# Altium schematic sheet Relay_5VDC.SchDoc
size 304 x 304 mm; SheetNumber: 8; SheetTotal: 8
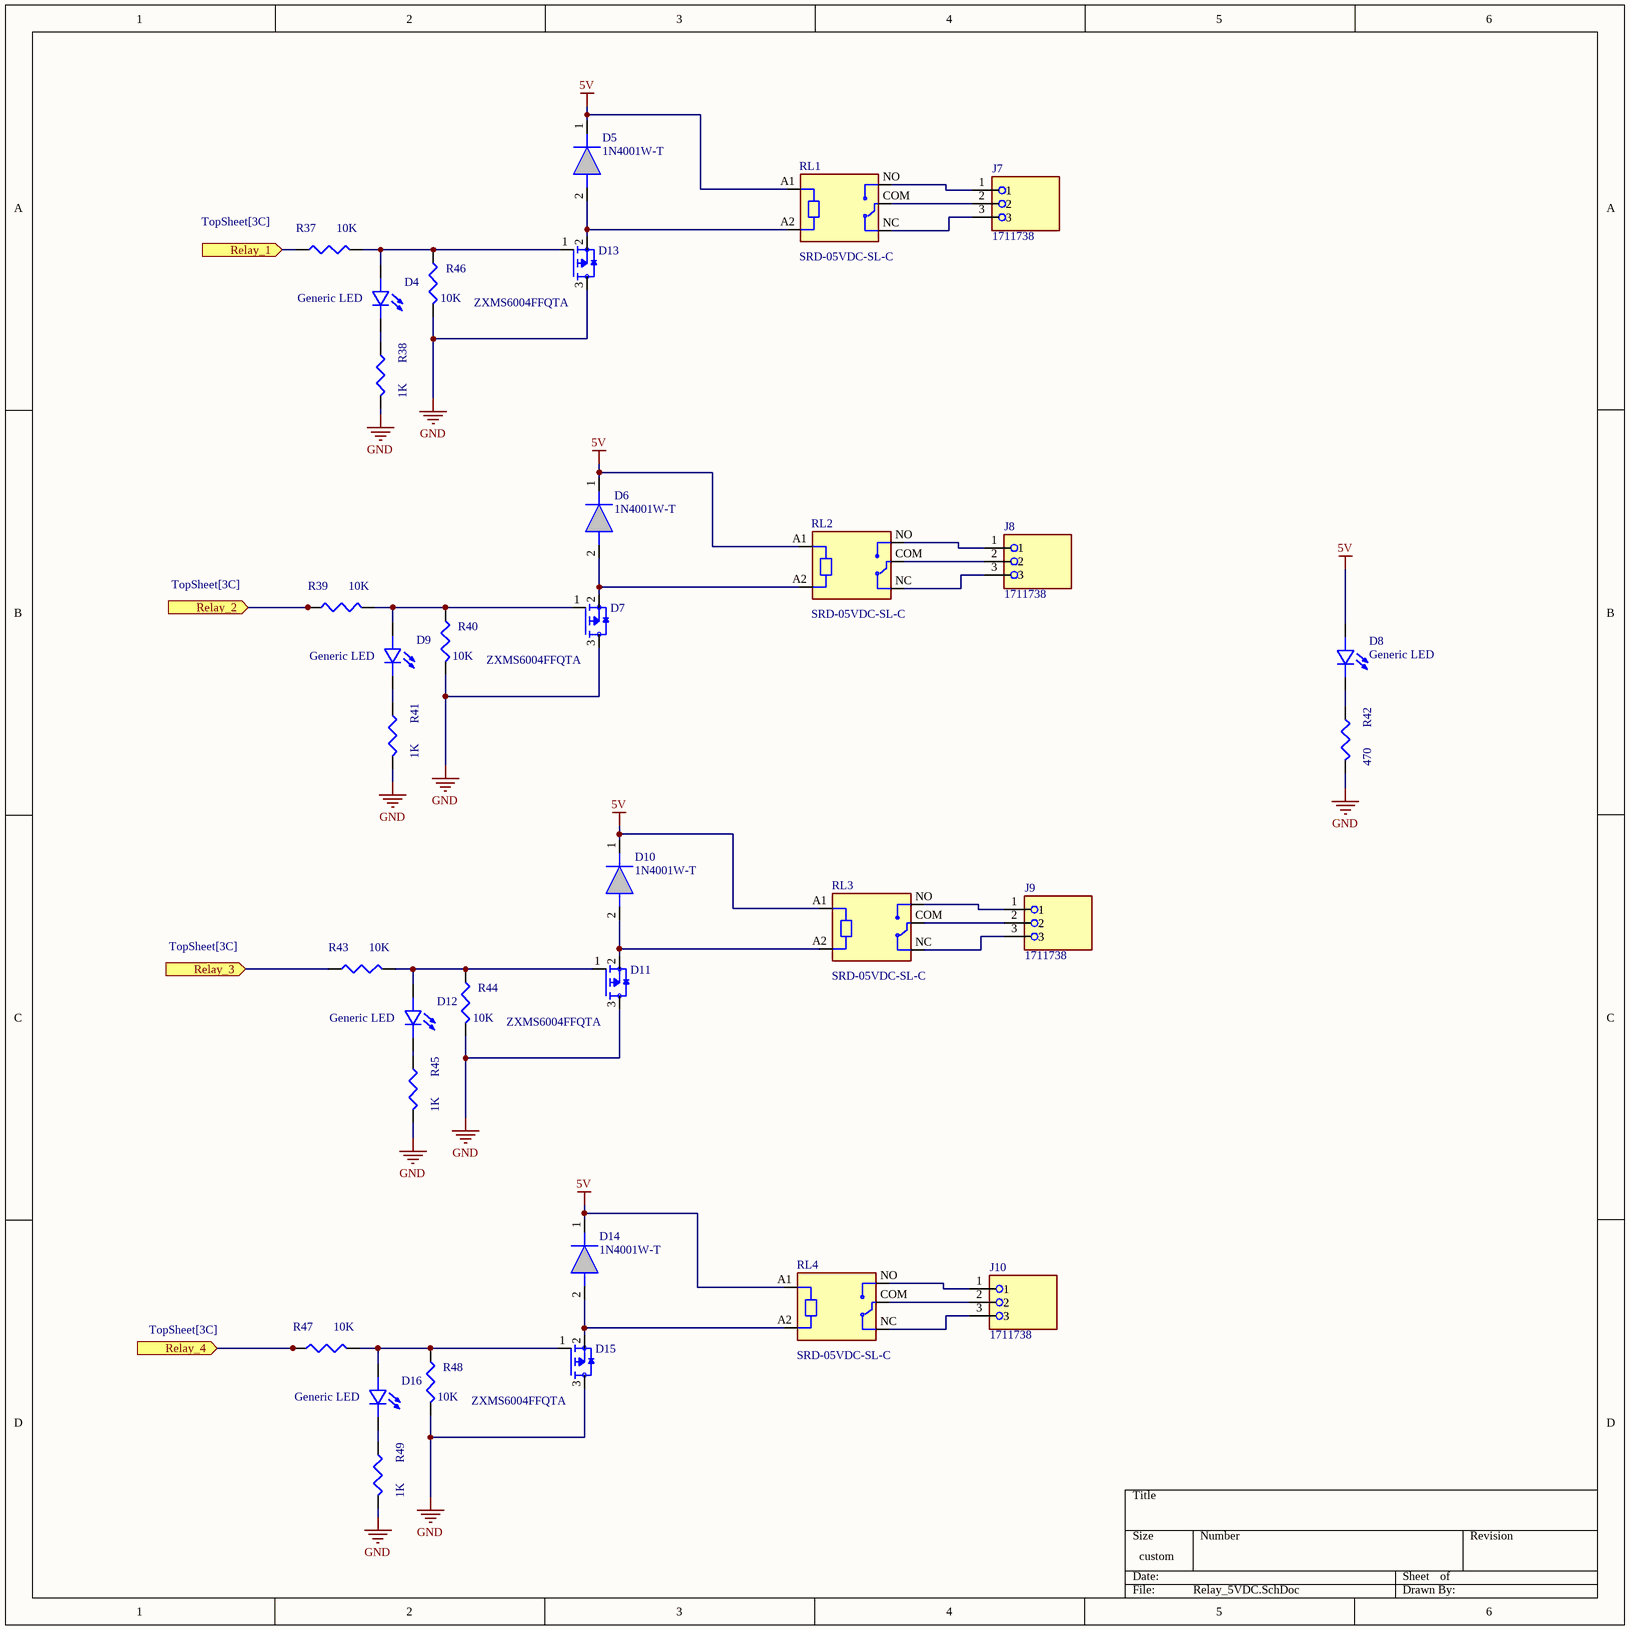
[diagram p0: Relay_5VDC.SchDoc]

## Parts
D4  Generic LED  [0603D-B]
D5  1N4001W-T  [SODFL3818X130N]
D6  1N4001W-T  [SODFL3818X130N]
D7  ZXMS6004FFQTA  [SOT95P240X100-3N]
D8  Generic LED  [0603D-B]
D9  Generic LED  [0603D-B]
D10  1N4001W-T  [SODFL3818X130N]
D11  ZXMS6004FFQTA  [SOT95P240X100-3N]
D12  Generic LED  [0603D-B]
D13  ZXMS6004FFQTA  [SOT95P240X100-3N]
D14  1N4001W-T  [SODFL3818X130N]
D15  ZXMS6004FFQTA  [SOT95P240X100-3N]
D16  Generic LED  [0603D-B]
J7  1711738  [1711738]
J8  1711738  [1711738]
J9  1711738  [1711738]
J10  1711738  [1711738]
R37  10K  [R0805]
R38  1K  [R0805]
R39  10K  [R0805]
R40  10K  [R0805]
R41  1K  [R0805]
R42  470  [R0603]
R43  10K  [R0805]
R44  10K  [R0805]
R45  1K  [R0805]
R46  10K  [R0805]
R47  10K  [R0805]
R48  10K  [R0805]
R49  1K  [R0805]
RL1  SRD-05VDC-SL-C  [SRD-05VDC-SL-C]
RL2  SRD-05VDC-SL-C  [SRD-05VDC-SL-C]
RL3  SRD-05VDC-SL-C  [SRD-05VDC-SL-C]
RL4  SRD-05VDC-SL-C  [SRD-05VDC-SL-C]

## Ports
Relay_1 (in, see TopSheet[3C]), Relay_2 (in, see TopSheet[3C]), Relay_3 (in, see TopSheet[3C]), Relay_4 (in, see TopSheet[3C])

## Nets
5V: D5.1(K) D6.1(K) D8.1(POS) D10.1(K) D14.1(K) RL1.A1 RL2.A1 RL3.A1 RL4.A1
GND: D7.3(D) D11.3(D) D13.3(D) D15.3(D) R38.2 R40.2 R41.2 R42.2 R44.2 R45.2 R46.2 R48.2 R49.2
Relay_1: R37.1 ; port Relay_1
Relay_2: R39.1 ; port Relay_2
Relay_3: R43.1 ; port Relay_3
Relay_4: R47.1 ; port Relay_4
NetD4_1: D4.1(POS) D13.1(G) R37.2 R46.1
NetD4_2: D4.2(NEG) R38.1
NetD5_2: D5.2(A) D13.2(S) RL1.A2
NetD6_2: D6.2(A) D7.2(S) RL2.A2
NetD7_1: D7.1(G) D9.1(POS) R39.2 R40.1
NetD8_2: D8.2(NEG) R42.1
NetD9_2: D9.2(NEG) R41.1
NetD10_2: D10.2(A) D11.2(S) RL3.A2
NetD11_1: D11.1(G) D12.1(POS) R43.2 R44.1
NetD12_2: D12.2(NEG) R45.1
NetD14_2: D14.2(A) D15.2(S) RL4.A2
NetD15_1: D15.1(G) D16.1(POS) R47.2 R48.1
NetD16_2: D16.2(NEG) R49.1
NetJ7_1: J7.1 RL1.NO
NetJ7_2: J7.2 RL1.COM
NetJ7_3: J7.3 RL1.NC
NetJ8_1: J8.1 RL2.NO
NetJ8_2: J8.2 RL2.COM
NetJ8_3: J8.3 RL2.NC
NetJ9_1: J9.1 RL3.NO
NetJ9_2: J9.2 RL3.COM
NetJ9_3: J9.3 RL3.NC
NetJ10_1: J10.1 RL4.NO
NetJ10_2: J10.2 RL4.COM
NetJ10_3: J10.3 RL4.NC

## Library data of the parts
D4 D8 D9 D12 D16 = LED: Generic LED SMD; MF: Osram; MP: LHN974 RED LED 1206; SnapEDA_Link: https://www.snapeda.com/parts/LHN974%20RED%20LED%201206/Osram/view-part/?ref=snap; Package: None; Value: *; Check_prices: https://www.snapeda.com/parts/LHN974%20RED%20LED%201206/Osram/view-part/?ref=eda
D5 D6 D10 D14 = 1N4001W-T: Rectifiers SOD-123,1A,50V,GP; Manufacturer_Name: Rectron; Geometry.Height: 1.3mm; Mouser Part Number: 583-1N4001W-T; Mouser Price/Stock: https://www.mouser.co.uk/ProductDetail/Rectron/1N4001W-T?qs=QNEnbhJQKvbnHIVMak28nQ%3D%3D; Manufacturer_Part_Number: 1N4001W-T; Datasheet Link: *
J7-J10 = 1711738: PCB Terminal Screw 5.08mm 12AWG 400V 24A 3 Position COMBICON MKDS Series | Phoenix Contact 1711738
R37-R49 = Resistor: This Library provides a comprehensive set of schematic symbols and PCB footprints for standard resistor packages (e.g., 0402, 0603, 0805, 1206).